# EAGLE design tick-mk-4.7.1 (EAGLE 6.5.0)
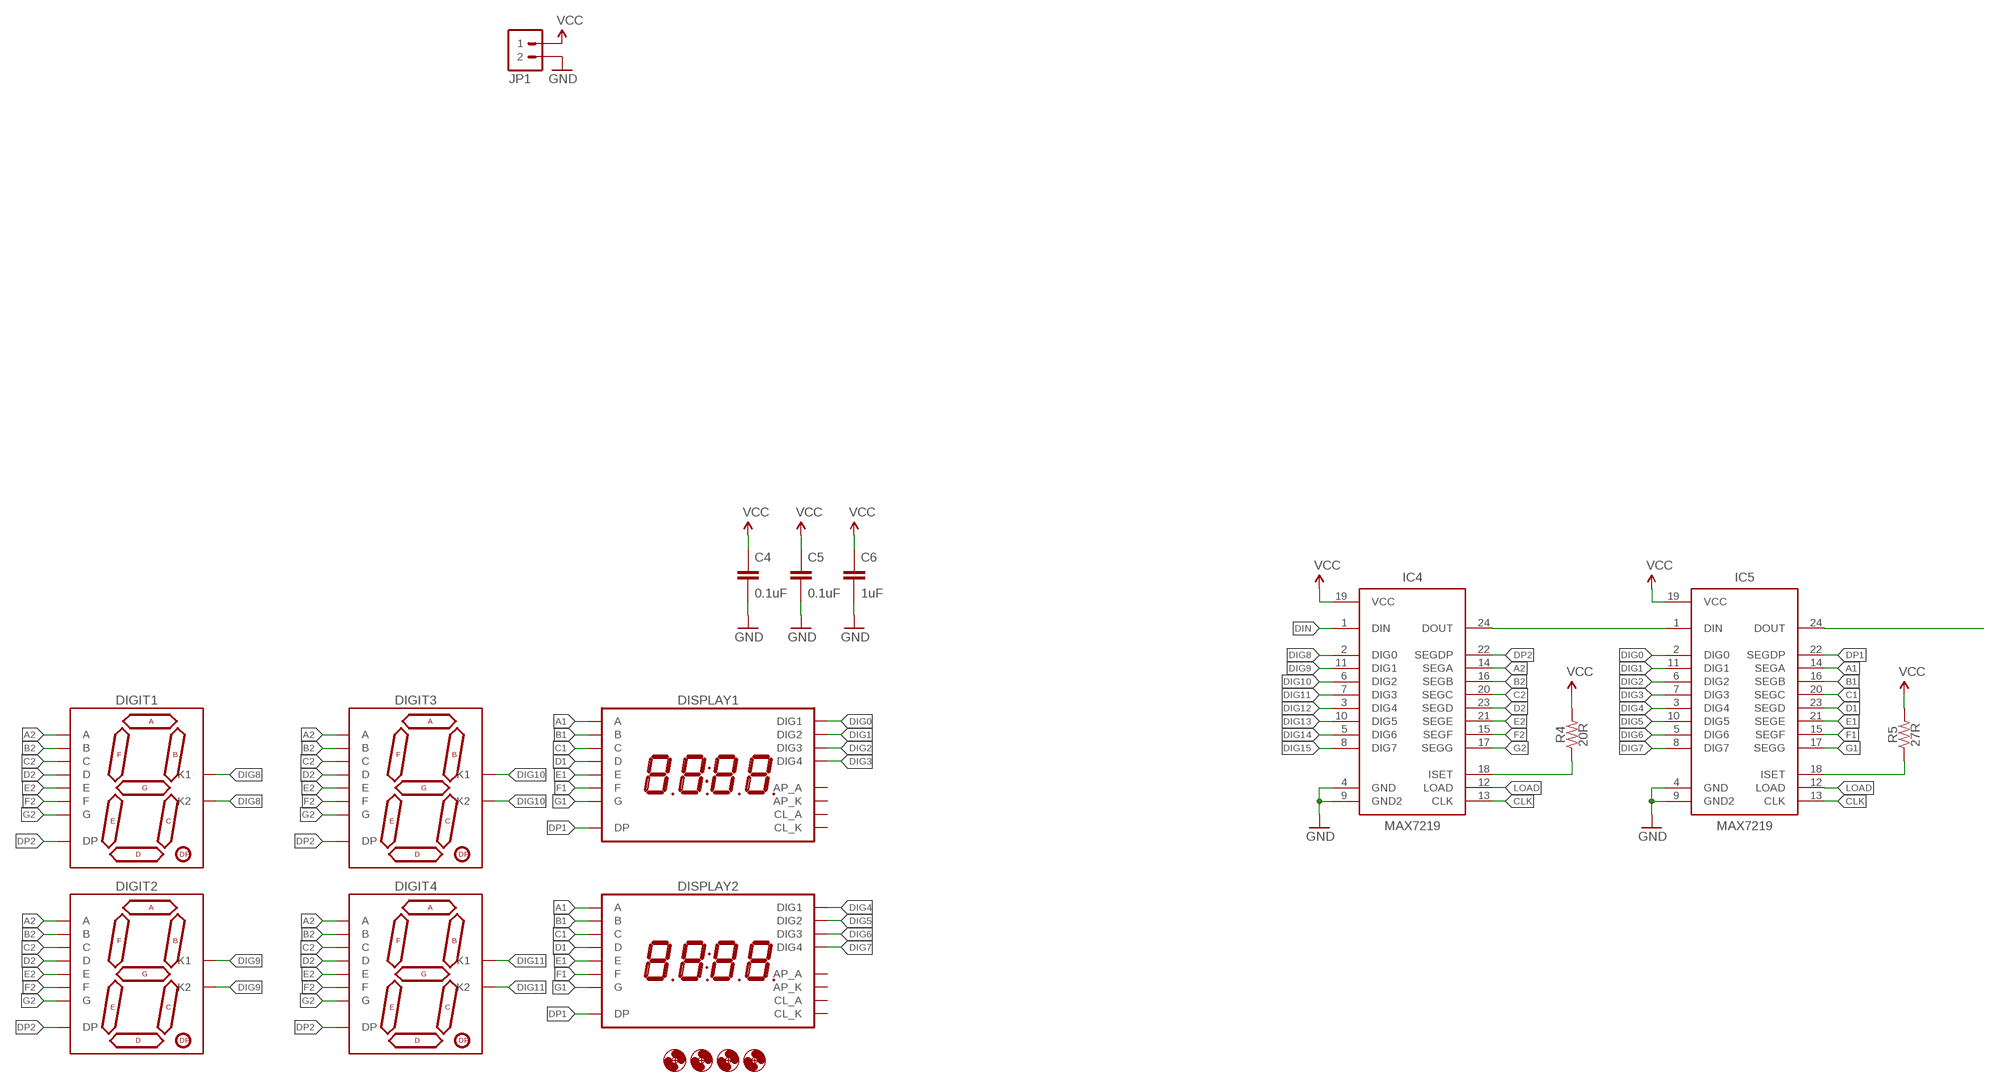
[diagram p0: schematic, sheet 1]

## Parts
C4  0.1uF  CAPACITOR-CERAMIC025-024X044  [C025-024X044]
C5  0.1uF  CAPACITOR-CERAMIC025-024X044  [C025-024X044]
C6  1uF  CAPACITOR-CERAMIC025-024X044  [C025-024X044]
DIGIT1  7SEG_1DIGPTH-25.4MM-BARE  [7SEG_1DIG_25.4MM_NOSILK]
DIGIT2  7SEG_1DIGPTH-25.4MM-BARE  [7SEG_1DIG_25.4MM_NOSILK]
DIGIT3  7SEG_1DIGPTH-25.4MM-BARE  [7SEG_1DIG_25.4MM_NOSILK]
DIGIT4  7SEG_1DIGPTH-25.4MM-BARE  [7SEG_1DIG_25.4MM_NOSILK]
DISPLAY1  7SEG_4DIGIT_COLON_APOS  [7SEG_4DIG_10MM]
DISPLAY2  7SEG_4DIGIT_COLON_APOS  [7SEG_4DIG_10MM]
H1  HOLE#2  [HOLE-#2]
H2  HOLE#2  [HOLE-#2]
H3  HOLE#2  [HOLE-#2]
H4  HOLE#2  [HOLE-#2]
IC4  MAX7219  MAX7219SOIC-W  [SO24W]
IC5  MAX7219  MAX7219SOIC-W  [SO24W]
JP1  M02JST-XH-VERT  [JST-2-XH-VERT-PTH]
R4  20R  RESISTORPTH-AXIAL-7.62MM  [RESISTOR-AXIAL-PTH-7.62MM]
R5  27R  RESISTORPTH-AXIAL-7.62MM  [RESISTOR-AXIAL-PTH-7.62MM]

## Nets
A1: DISPLAY1.14(A) DISPLAY2.14(A) IC5.14(SEGA)
A2: DIGIT1.7(A) DIGIT2.7(A) DIGIT3.7(A) DIGIT4.7(A) IC4.14(SEGA)
B1: DISPLAY1.16(B) DISPLAY2.16(B) IC5.16(SEGB)
B2: DIGIT1.6(B) DIGIT2.6(B) DIGIT3.6(B) DIGIT4.6(B) IC4.16(SEGB)
C1: DISPLAY1.13(C) DISPLAY2.13(C) IC5.20(SEGC)
C2: DIGIT1.4(C) DIGIT2.4(C) DIGIT3.4(C) DIGIT4.4(C) IC4.20(SEGC)
CLK: IC4.13(CLK) IC5.13(CLK)
D1: DISPLAY1.3(D) DISPLAY2.3(D) IC5.23(SEGD)
D2: DIGIT1.2(D) DIGIT2.2(D) DIGIT3.2(D) DIGIT4.2(D) IC4.23(SEGD)
DIG0: DISPLAY1.1(DIG1) IC5.2(DIG0)
DIG1: DISPLAY1.2(DIG2) IC5.11(DIG1)
DIG2: DISPLAY1.6(DIG3) IC5.6(DIG2)
DIG3: DISPLAY1.8(DIG4) IC5.7(DIG3)
DIG4: DISPLAY2.1(DIG1) IC5.3(DIG4)
DIG5: DISPLAY2.2(DIG2) IC5.10(DIG5)
DIG6: DISPLAY2.6(DIG3) IC5.5(DIG6)
DIG7: DISPLAY2.8(DIG4) IC5.8(DIG7)
DIG8: DIGIT1.3(K1) DIGIT1.8(K2) IC4.2(DIG0)
DIG9: DIGIT2.3(K1) DIGIT2.8(K2) IC4.11(DIG1)
DIG10: DIGIT3.3(K1) DIGIT3.8(K2) IC4.6(DIG2)
DIG11: DIGIT4.3(K1) DIGIT4.8(K2) IC4.7(DIG3)
DIG12: IC4.3(DIG4)
DIG13: IC4.10(DIG5)
DIG14: IC4.5(DIG6)
DIG15: IC4.8(DIG7)
DIN: IC4.1(DIN)
DOUT: IC4.24(DOUT) IC5.1(DIN)
DP1: DISPLAY1.7(DP) DISPLAY2.7(DP) IC5.22(SEGDP)
DP2: DIGIT1.5(DP) DIGIT2.5(DP) DIGIT3.5(DP) DIGIT4.5(DP) IC4.22(SEGDP)
E1: DISPLAY1.5(E) DISPLAY2.5(E) IC5.21(SEGE)
E2: DIGIT1.1(E) DIGIT2.1(E) DIGIT3.1(E) DIGIT4.1(E) IC4.21(SEGE)
F1: DISPLAY1.11(F) DISPLAY2.11(F) IC5.15(SEGF)
F2: DIGIT1.9(F) DIGIT2.9(F) DIGIT3.9(F) DIGIT4.9(F) IC4.15(SEGF)
G1: DISPLAY1.15(G) DISPLAY2.15(G) IC5.17(SEGG)
G2: DIGIT1.10(G) DIGIT2.10(G) DIGIT3.10(G) DIGIT4.10(G) IC4.17(SEGG)
GND: C4.2 C5.2 C6.2 IC4.4(GND) IC4.9(GND2) IC5.4(GND) IC5.9(GND2) JP1.2
LOAD: IC4.12(LOAD) IC5.12(LOAD)
N$6: IC5.24(DOUT)
N$11: IC5.18(ISET) R5.P$1
N$12: IC4.18(ISET) R4.P$1
VCC: C4.1 C5.1 C6.1 IC4.19(VCC) IC5.19(VCC) JP1.1 R4.P$2 R5.P$2
Unconnected: DISPLAY1.4(CL_A) DISPLAY1.9(AP_K) DISPLAY1.10(AP_A) DISPLAY1.12(CL_K) DISPLAY2.4(CL_A) DISPLAY2.9(AP_K) DISPLAY2.10(AP_A) DISPLAY2.12(CL_K)

## Library data of the parts
C4-C6 = A_butts:CAPACITOR-CERAMIC: CAPACITOR, European symbol
DIGIT1-DIGIT4 = A_butts:7SEG_1DIG
DISPLAY1 DISPLAY2 = A_butts:7SEG_4DIGIT_COLON_APOS
H1-H4 = A_butts:HOLE: MOUNTING HOLE with drill center marker
IC4 IC5 = A_butts:MAX7219: 8-digit, 8-segment LED display driver, serial input
JP1 = A_butts:M02: Standard 2-pin 0.1" header. Use with - straight break away headers ( PRT-00116) - right angle break away headers (PRT-00553) - swiss pins (PRT-00743) - machine pins (PRT-00117) - female headers (PRT-00115) Molex polarized connector foot print use with: PRT-08233 with associated crimp pins and housings. 2.54_SCREWTERM for use with PRT-10571. 3.5mm Screw Terminal footprints for PRT-08084 5mm Screw Terminal footprints for use with PRT-08433
R4 R5 = A_butts:RESISTOR: RESISTOR, American symbol

## Board
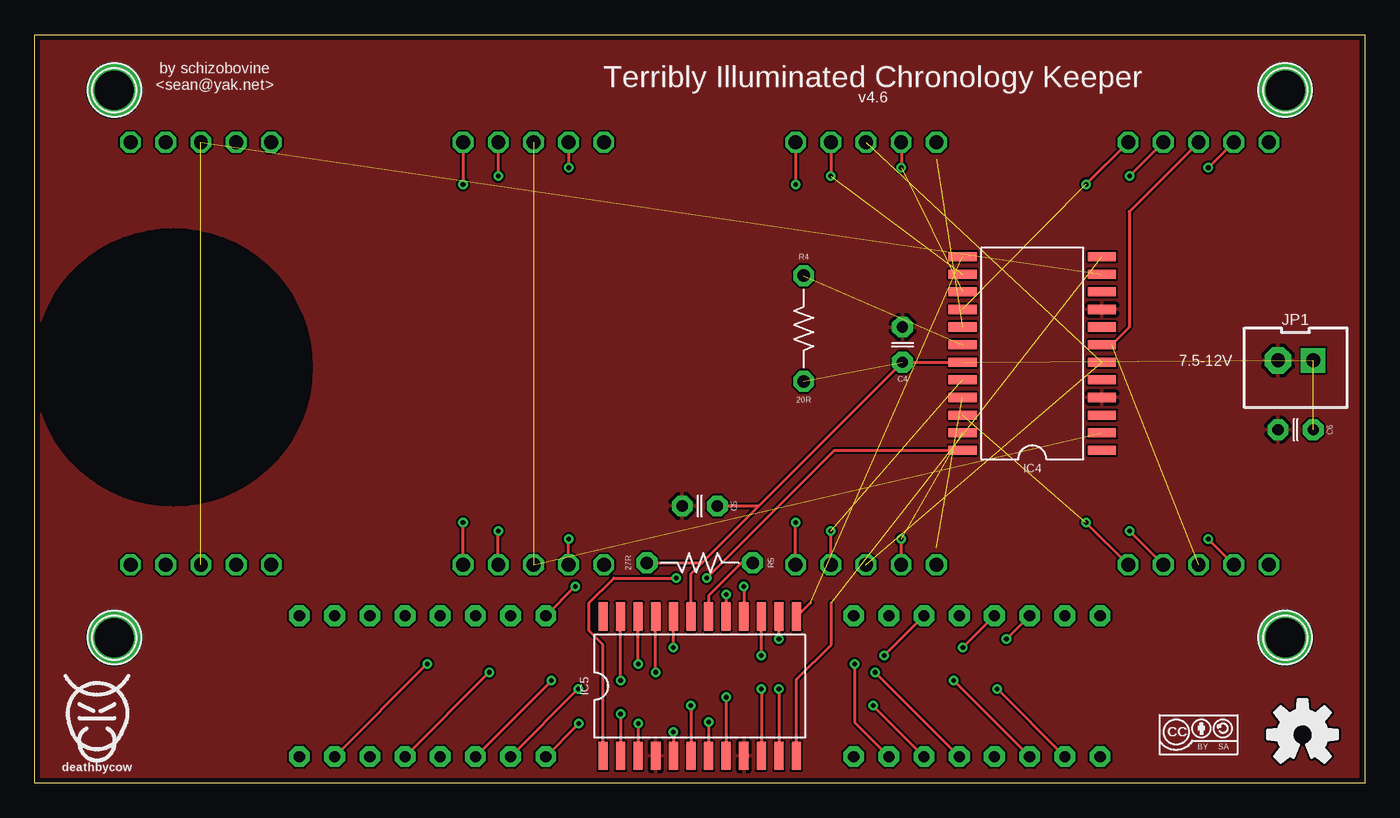
[diagram p1: board, top side]
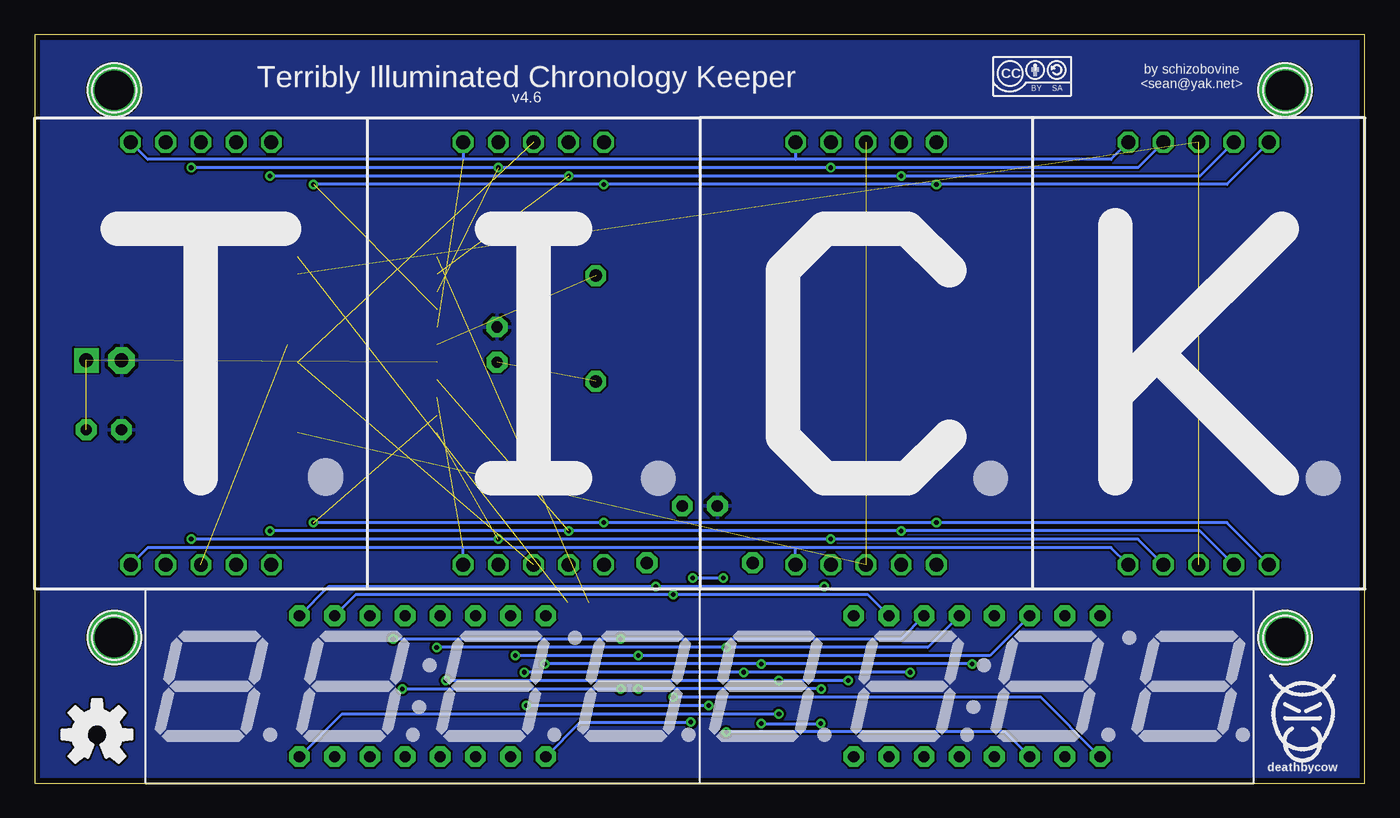
[diagram p2: board, bottom side, seen from below]

Size 96 x 54 mm. Coordinates in mm from the lower left corner, seen from the top.
Outline: 0,54 96,54 96,0 0,0 0,54
Copper layers (1*16): Top 0.0356mm / dielectric 1.5011mm / Bottom 0.0356mm
Design rules "LaenPCBOrder2": minimum track width 6mil, minimum drill 13mil, track to track 6mil, track to pad 6mil, pad to pad 6mil, via to via 6mil, smd to smd 6mil, copper to edge 15mil, drill to drill 6mil, minimum pad ring 7mil, minimum via ring 7mil, stop-mask expansion 3mil, vias tented up to drill 20mil, thermal gap 10mil

### Footprints (pad centres in the part's own frame; a part is rotated, then mirrored left to right if it is on the bottom)
C025-024X044 = drill 0.813 pad 1.5 octagon: 1 -1.27,0; 2 1.27,0
7SEG_1DIG_25.4MM_NOSILK = drill 1 pad 1.5 octagon: 1 -5.08,-15.24; 2 -2.54,-15.24; 3 0,-15.24; 4 2.54,-15.24; 5 5.08,-15.24; 6 5.08,15.24; 7 2.54,15.24; 8 0,15.24; 9 -2.54,15.24; 10 -5.08,15.24
7SEG_4DIG_10MM = drill 0.8 pad 1.5 octagon: 1 -8.89,-5.08; 2 -6.35,-5.08; 3 -3.81,-5.08; 4 -1.27,-5.08; 5 1.27,-5.08; 6 3.81,-5.08; 7 6.35,-5.08; 8 8.89,-5.08; 9 8.89,5.08; 10 6.35,5.08; 11 3.81,5.08; 12 1.27,5.08; 13 -1.27,5.08; 14 -3.81,5.08; 15 -6.35,5.08; 16 -8.89,5.08
HOLE-#2 = drill 2.8 pad 3.81: P$1 0,0
SO24W = smd 0.66 x 2.032: 1 -6.985,-5.029; 2 -5.715,-5.029; 3 -4.445,-5.029; 4 -3.175,-5.029; 5 -1.905,-5.029; 6 -0.635,-5.029; 7 0.635,-5.029; 8 1.905,-5.029; 9 3.175,-5.029; 10 4.445,-5.029; 11 5.715,-5.029; 12 6.985,-5.029; 13 6.985,5.029; 14 5.715,5.029; 15 4.445,5.029; 16 3.175,5.029; 17 1.905,5.029; 18 0.635,5.029; 19 -0.635,5.029; 20 -1.905,5.029; 21 -3.175,5.029; 22 -4.445,5.029; 23 -5.715,5.029; 24 -6.985,5.029
JST-2-XH-VERT-PTH = drill 1 pad 1.778 square: 1 -1.27,0 | drill 1 pad 1.93 octagon: 2 1.27,0
RESISTOR-AXIAL-PTH-7.62MM = drill 0.9 pad 1.5 octagon: P$1 -3.81,0; P$2 3.81,0

### Placement (x,y rotation side)
C4  62.63,31.64 90 top
C5  48,20 180 top
C6  91,25.5 180 top
DIGIT1  36,31 0 bottom
DIGIT2  12,31 0 bottom
DIGIT3  60,31 0 bottom
DIGIT4  84,31 0 bottom
DISPLAY1  68,7 0 bottom
DISPLAY2  28,7 0 bottom
H1  5.75,10.5 0 top
H2  5.75,50 0 top
H3  90.25,10.5 0 top
H4  90.25,50 0 top
IC4  72,31 90 top
IC5  48,7 0 top
JP1  91,30.5 180 top
R4  55.5,32.8 270 top
R5  48,15.9 180 top
U$1  [COW_SMALL]  4.5,5.2 0 top
U$2  [CC-BY-SA-4.0-NO-URL]  24,51 0 bottom
U$3  [CC-BY-SA-4.0-NO-URL]  84,3.5 0 top
U$4  [COW_SMALL]  4.5,5.2 0 bottom
U$5  [OSHWLOGO_TOP_0.2]  91.5,3.5 0 top
U$8  [OSHWLOGO_TOP_0.2]  91.5,3.5 0 bottom

### Tracks (layer width: path | path; a pad name or v marks a point on that pad's centre or on a via)
A1  (via drill 0.33)
  Top 0.2: v70.13,10.4 DISPLAY1.14 | v53.72,10.4 IC5.14
  Bottom 0.2: DISPLAY2.14 33.49,10.4 v53.72,10.4 v70.13,10.4
A2  (via drill 0.33)  (1 unrouted)
  Top 0.2: v79.02,43.8 DIGIT4.7 | DIGIT3.7 v57.46,43.8 | DIGIT1.7 v33.46,43.8
  Bottom 0.2: DIGIT2.7 11.9,43.8 v33.46,43.8 v57.46,43.8 v79.02,43.8
B1  (via drill 0.33)
  Top 0.2: v39.01,14.2 DISPLAY2.16 | v51.17,14.2 IC5.16
  Bottom 0.2: DISPLAY1.16 74.77,14.2 v51.17,14.2 v39.01,14.2
B2  (via drill 0.33)  (1 unrouted)
  Top 0.2: v75.88,43.2 DIGIT4.6 | DIGIT3.6 v54.92,43.2 | DIGIT1.6 v30.92,43.2
  Bottom 0.2: DIGIT2.6 9.96,43.2 v30.92,43.2 v54.92,43.2 v75.88,43.2
C1  (via drill 0.33)
  Top 0.2: v66.99,9.8 DISPLAY1.13 | v46.09,9.8 IC5.20
  Bottom 0.2: DISPLAY2.13 31.55,9.8 v46.09,9.8 v66.99,9.8
C2  (via drill 0.33)  (1 unrouted)
  Top 0.2: v79.02,18.2 DIGIT4.4 | DIGIT1.4 v33.46,18.2 | DIGIT3.4 v57.46,18.2
  Bottom 0.2: DIGIT2.4 11.9,18.2 v33.46,18.2 v57.46,18.2 v79.02,18.2
CLK  (1 unrouted)
  Top 0.2: IC5.13 55.03,12.03 56,13
D1  (via drill 0.33)
  Top 0.2: DISPLAY2.3 v37.29,7.4 | v66.33,7.4 DISPLAY1.3 | v42.28,7.4 IC5.23
  Bottom 0.2: v37.29,7.4 v42.28,7.4 v66.33,7.4
D2  (via drill 0.33)  (1 unrouted)
  Top 0.2: v84.7,17.6 DIGIT4.2 | DIGIT1.2 v38.54,17.6 | DIGIT3.2 v62.54,17.6
  Bottom 0.2: DIGIT2.2 16.38,17.6 v38.54,17.6 v62.54,17.6 v84.7,17.6
DIG0  (via drill 0.33)
  Top 0.2: v42.28,5 IC5.2
  Bottom 0.2: DISPLAY1.1 73.81,5 v42.28,5
DIG1  (via drill 0.33)
  Top 0.2: DISPLAY1.2 v69.47,6.8 | v53.72,6.8 IC5.11
  Bottom 0.2: v69.47,6.8 v53.72,6.8
DIG2  (via drill 0.33)
  Top 0.2: v60.51,5.6 DISPLAY1.6 | v47.37,5.6 IC5.6
  Bottom 0.2: v47.37,5.6 v60.51,5.6
DIG3  (via drill 0.33)
  Top 0.2: v48.63,4.4 IC5.7
  Bottom 0.2: DISPLAY1.8 56.63,4.4 v48.63,4.4
DIG4  (via drill 0.33)
  Top 0.2: DISPLAY2.1 v39.27,4.3 | v43.55,4.3 IC5.3
  Bottom 0.2: v43.55,4.3 v39.27,4.3
DIG5  (via drill 0.33)
  Top 0.2: DISPLAY2.2 v39.23,6.8 | v52.45,6.8 IC5.10
  Bottom 0.2: v39.23,6.8 v52.45,6.8
DIG6  (via drill 0.33)
  Top 0.2: v46.1,3.7 IC5.5
  Bottom 0.2: DISPLAY2.6 25.97,3.7 v46.1,3.7
DIG7  (via drill 0.33)
  Top 0.2: v49.9,6.2 IC5.8
  Bottom 0.2: DISPLAY2.8 23.39,6.2 v49.9,6.2
DIG8  (2 unrouted)
DIG9  (2 unrouted)
DIG10  (2 unrouted)
DIG11  (1 unrouted)
  Top 0.2: DIGIT4.8 79,41.24 79,32.9 77.73,31.64 IC4.7
DOUT  (via drill 0.33)
  Top 0.2: IC5.1 41.02,9.98 40,11 40,13 41.8,14.8 v46.3,14.8 | v48.5,14.8 57.72,24.02 IC4.24
  Bottom 0.2: v46.3,14.8 v48.5,14.8
DP1  (via drill 0.33)
  Top 0.2: DISPLAY2.7 v28.33,8.6 | v43.55,8.6 IC5.22 | v59.17,8.6 59.17,4.4 DISPLAY1.7
  Bottom 0.2: v28.33,8.6 v43.55,8.6 v59.17,8.6
DP2  (via drill 0.33)  (1 unrouted)
  Top 0.2: v75.88,18.8 DIGIT4.5 | DIGIT1.5 v30.92,18.8 | DIGIT3.5 v54.92,18.8
  Bottom 0.2: DIGIT2.5 9.96,18.8 v30.92,18.8 v54.92,18.8 v75.88,18.8
E1  (via drill 0.33)
  Top 0.2: DISPLAY2.5 v32.81,8 | v60.65,8 DISPLAY1.5 | v44.83,8 IC5.21
  Bottom 0.2: v32.81,8 v44.83,8 v60.65,8
E2  (1 unrouted)
  Bottom 0.2: DIGIT2.1 18.32,17 41.08,17 | 41.08,17 65.08,17 | 65.08,17 87.84,17 DIGIT4.1 | DIGIT1.1 41.08,17 | DIGIT3.1 65.08,17
F1  (via drill 0.33)
  Top 0.2: v61.31,9.2 DISPLAY1.11 | v52.45,9.2 IC5.15
  Bottom 0.2: DISPLAY2.11 27.07,9.2 v52.45,9.2 v61.31,9.2
F2  (via drill 0.33)  (1 unrouted)
  Top 0.2: v84.7,44.4 DIGIT4.9 | DIGIT3.9 v62.54,44.4 | DIGIT1.9 v38.54,44.4
  Bottom 0.2: DIGIT2.9 16.38,44.4 v38.54,44.4 v62.54,44.4 v84.7,44.4
G1  (via drill 0.33)
  Top 0.2: v49.91,13.6 IC5.17
  Bottom 0.2: DISPLAY2.15 35.87,13.6 v49.91,13.6 72.83,13.6 DISPLAY1.15
G2  (1 unrouted)
  Bottom 0.2: DIGIT2.10 18.32,45 41.08,45 | 41.08,45 65.08,45 | 65.08,45 87.84,45 DIGIT4.10 | DIGIT3.10 65.08,45 | DIGIT1.10 41.08,45
GND
  pour Bottom: 0,54 96,54 96,0 0,0
  pour Top: 0,54 96,54 96,0 0,0
LOAD  (1 unrouted)
  Top 0.2: IC5.12 54.98,7.49 57.5,10 57.5,13 | IC4.12 77,38.01 77,38.1
N$5
  cutout Top: 10,20 arc-90 0,30 arc-90 10,40 arc-90 20,30 arc-90
N$11
  Top 0.2: R5.P$1 51,15.9 48.63,13.54 IC5.18
N$12  (1 unrouted)
VCC  (3 unrouted)
  Top 0.2: IC5.19 47.37,15.1 48.17,15.9 | 48.17,15.9 52.28,20.02 | 52.28,20.02 C4.1 IC4.19 | R5.P$2 48.17,15.9 | C5.1 49.28,20.02 52.28,20.02

### Text on the board
tPlace: by schizobovine / <sean@yak.net> | Terribly Illuminated Chronology Keeper | v4.6 | 7.5-12V
bPlace: by schizobovine / <sean@yak.net> | Terribly Illuminated Chronology Keeper | v4.6